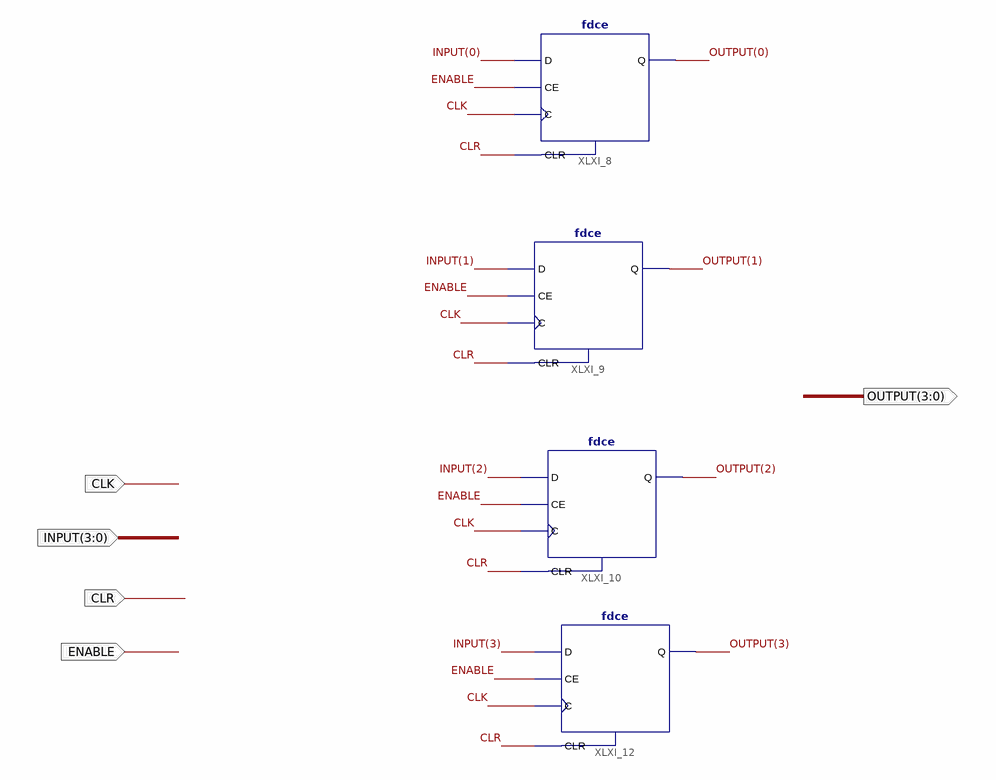
[diagram p0: schematic sheet 1]
// Xilinx ISE schematic LATCH4.sch (artix7) as structural Verilog: 4 symbols, 5 ports
module LATCH4 (
  input  CLK,
  input  [3:0] INPUT,
  input  CLR,
  input  ENABLE,
  output [3:0] OUTPUT
);

  fdce XLXI_8 (.C(CLK), .CE(ENABLE), .CLR(CLR), .D(INPUT[0]), .Q(OUTPUT[0]));
  fdce XLXI_9 (.C(CLK), .CE(ENABLE), .CLR(CLR), .D(INPUT[1]), .Q(OUTPUT[1]));
  fdce XLXI_10 (.C(CLK), .CE(ENABLE), .CLR(CLR), .D(INPUT[2]), .Q(OUTPUT[2]));
  fdce XLXI_12 (.C(CLK), .CE(ENABLE), .CLR(CLR), .D(INPUT[3]), .Q(OUTPUT[3]));
endmodule
